# Altium schematic sheet 摄像头直立.SchDoc
size A3
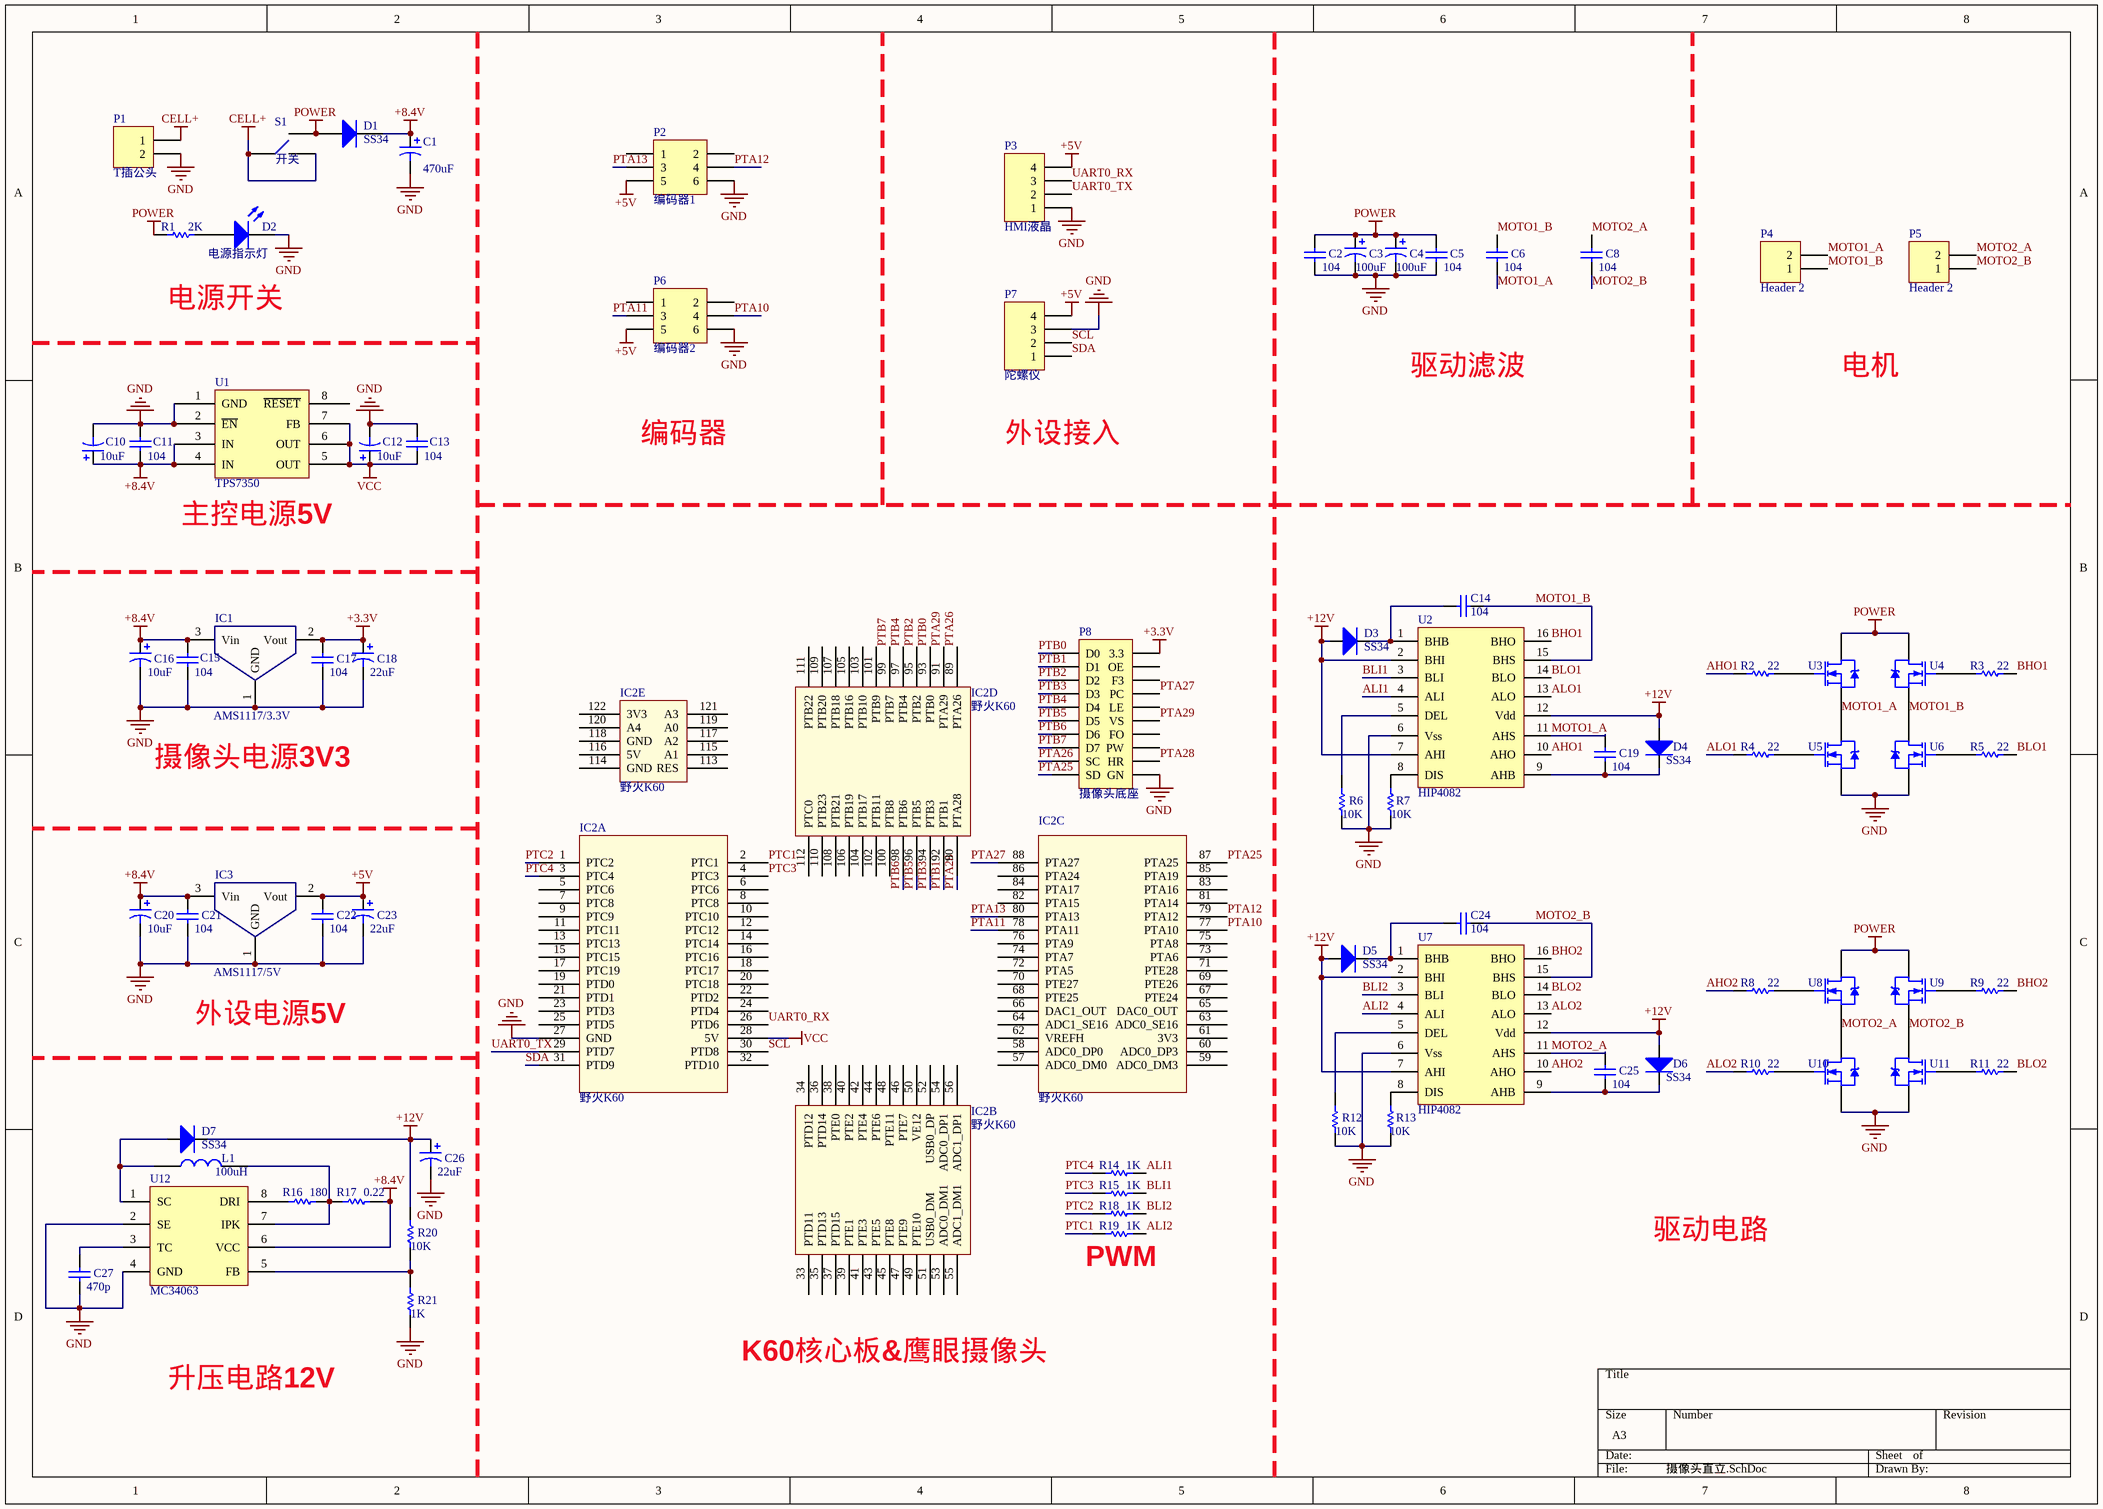
[diagram p0: 摄像头直立.SchDoc]

## Parts
C1  value 470uF  [CAP_ELEC_250P680X1220_FLAT2]  (hidden comment: Cap Pol1)
C2  value 104  [CAP_0805]  (hidden comment: Cap)
C3  value 100uF  [CAP_ELEC_250P680X1220_VERT]
C4  value 100uF  [CAP_ELEC_250P680X1220_VERT]
C5  value 104  [CAP_0805]  (hidden comment: Cap)
C6  value 104  [CAP_0805]  (hidden comment: Cap)
C8  value 104  [CAP_0805]  (hidden comment: Cap)
C10  value 10uF  [CAP_0805]  (hidden comment: Cap)
C11  value 104  [CAP_0805]  (hidden comment: Cap)
C12  value 10uF  [CAP_0805]  (hidden comment: Cap)
C13  value 104  [CAP_0805]  (hidden comment: Cap)
C14  value 104  [CAP_0805]  (hidden comment: Cap)
C15  value 104  [CAP_0805]  (hidden comment: Cap)
C16  value 10uF  [CAP_0805]  (hidden comment: Cap Pol1)
C17  value 104  [CAP_0805]  (hidden comment: Cap)
C18  value 22uF  [CAP_0805]  (hidden comment: Cap Pol1)
C19  value 104  [CAP_0805]
C20  value 10uF  [CAP_0805]  (hidden comment: Cap Pol1)
C21  value 104  [CAP_0805]  (hidden comment: Cap)
C22  value 104  [CAP_0805]  (hidden comment: Cap)
C23  value 22uF  [CAP_0805]  (hidden comment: Cap Pol1)
C24  value 104  [CAP_0805]  (hidden comment: Cap)
C25  value 104  [CAP_0805]
C26  value 22uF  [CAP_0805]  (hidden comment: Cap Pol1)
C27  value 470p  [CAP_0805]  (hidden comment: Cap)
D1  SS34  [SMA]
D2  电源指示灯  [DIO_0805]
D3  SS34  [SMA]
D4  SS34  [SMA]
D5  SS34  [SMA]
D6  SS34  [SMA]
D7  SS34  [SMA]
IC1  AMS1117/3.3V  [SOT_223]
IC2  野火K60  [fireK60]  (parts A,B,C,D,E of 5)
IC3  AMS1117/5V  [SOT_223]
L1  value 100uH  [L-5X4mm-S]  (hidden comment: inductor)
P1  T插公头  [T(G)]
P2  编码器1  [201R2X3]
P3  HMI液晶  [HDR1*4]
P4  Header 2  [CON_5.08*2]
P5  Header 2  [CON_5.08*2]
P6  编码器2  [201R2X3]
P7  陀螺仪  [HDR1*4]
P8  摄像头底座  [摄像头]
R1  value 2K  [RES_0805]  (hidden comment: Res1)
R2  value 22  [RES_0805]  (hidden comment: Res1)
R3  value 22  [RES_0805]  (hidden comment: Res1)
R4  value 22  [RES_0805]  (hidden comment: Res1)
R5  value 22  [RES_0805]  (hidden comment: Res1)
R6  value 10K  [RES_0805]  (hidden comment: Res1)
R7  value 10K  [RES_0805]  (hidden comment: Res1)
R8  value 22  [RES_0805]  (hidden comment: Res1)
R9  value 22  [RES_0805]  (hidden comment: Res1)
R10  value 22  [RES_0805]  (hidden comment: Res1)
R11  value 22  [RES_0805]  (hidden comment: Res1)
R12  value 10K  [RES_0805]  (hidden comment: Res1)
R13  value 10K  [RES_0805]  (hidden comment: Res1)
R14  value 1K  [RES_0805]
R15  value 1K  [RES_0805]
R16  value 180  [RES_0805]
R17  value 0.22  [RES_1206]
R18  value 1K  [RES_0805]
R19  value 1K  [RES_0805]
R20  value 10K  [RES_0805]
R21  value 1K  [RES_0805]
S1  开关  [slide_switch]
U1  TPS7350  [SOP_8]
U2  HIP4082  [HIP4082b]
U3  irlr7843  [TO-252AA]  (value not drawn)
U4  irlr7843  [TO-252AA]  (value not drawn)
U5  irlr7843  [TO-252AA]  (value not drawn)
U6  irlr7843  [TO-252AA]  (value not drawn)
U7  HIP4082  [HIP4082b]
U8  irlr7843  [TO-252AA]  (value not drawn)
U9  irlr7843  [TO-252AA]  (value not drawn)
U10  irlr7843  [TO-252AA]  (value not drawn)
U11  irlr7843  [TO-252AA]  (value not drawn)
U12  MC34063  [SOP_8]

## Nets
+3.3V: C17.2 C18.1 IC1.2(Vout) P8.2(3.3)
+5V: C22.2 C23.1 IC3.2(Vout) P2.5 P3.4 P6.5 P7.4
+8.4V: C1.1 C10.1 C11.1 C15.2 C16.1 C20.1 C21.2 D1.2(K) IC1.3(Vin) IC3.3(Vin) R17.1 U1.3(IN) U1.4(IN) U12.6(VCC)
+12V: C26.1 D3.1(A) D4.1(A) D5.1(A) D6.1(A) D7.2(K) R20.2 U2.2(BHI) U2.7(AHI) U2.12(Vdd) U7.2(BHI) U7.7(AHI) U7.12(Vdd)
CELL+: P1.1 S1.1 S1.3
GND: C1.2 C2.2 C3.2 C4.2 C5.2 C10.2 C11.2 C12.2 C13.1 C15.1 C16.2 C17.1 C18.2 C20.2 C21.1 C22.1 C23.2 C26.2 C27.1 D2.2(K) IC1.1(GND) IC2.27(GND) IC3.1(GND) P1.2 P2.6 P3.1 P6.6 P7.3 P8.20(GN) R6.1 R7.1 R12.1 R13.1 R21.1 U1.1(GND) U1.2(~{EN}) U2.6(Vss) U5.S U6.S U7.6(Vss) U10.S U11.S U12.2(SE) U12.4(GND)
POWER: C2.1 C3.1 C4.1 C5.1 D1.1(A) R1.2 S1.2 U3.D U4.D U8.D U9.D
VCC: C12.1 C13.2 IC2.28(5V) U1.5(OUT) U1.6(OUT) U1.7(FB)
AHO1: R2.2 U2.10(AHO)
AHO2: R8.2 U7.10(AHO)
ALI1: R14.1 U2.4(ALI)
ALI2: R19.1 U7.4(ALI)
ALO1: R4.2 U2.13(ALO)
ALO2: R10.2 U7.13(ALO)
BHO1: R3.1 U2.16(BHO)
BHO2: R9.1 U7.16(BHO)
BLI1: R15.1 U2.3(BLI)
BLI2: R18.1 U7.3(BLI)
BLO1: R5.1 U2.14(BLO)
BLO2: R11.1 U7.14(BLO)
MOTO1_A: C6.2 C19.2 P4.2 U2.11(AHS) U3.S U5.D
MOTO1_B: C6.1 C14.1 P4.1 U2.15(BHS) U4.S U6.D
MOTO2_A: C8.1 C25.2 P5.2 U7.11(AHS) U8.S U10.D
MOTO2_B: C8.2 C24.1 P5.1 U7.15(BHS) U9.S U11.D
PTA10: IC2.77(PTA10) P6.4
PTA11: IC2.78(PTA11) P6.3
PTA12: IC2.79(PTA12) P2.4
PTA13: IC2.80(PTA13) P2.3
PTA25: IC2.87(PTA25) P8.19(SD)
PTA26: IC2.89(PTA26) P8.17(SC)
PTA27: IC2.88(PTA27) P8.8(PC)
PTA28: IC2.90(PTA28) P8.18(HR)
PTA29: IC2.91(PTA29) P8.12(VS)
PTB0: IC2.93(PTB0) P8.1(D0)
PTB1: IC2.92(PTB1) P8.3(D1)
PTB2: IC2.95(PTB2) P8.5(D2)
PTB3: IC2.94(PTB3) P8.7(D3)
PTB4: IC2.97(PTB4) P8.9(D4)
PTB5: IC2.96(PTB5) P8.11(D5)
PTB6: IC2.98(PTB6) P8.13(D6)
PTB7: IC2.99(PTB7) P8.15(D7)
PTC1: IC2.2(PTC1) R19.2
PTC2: IC2.1(PTC2) R18.2
PTC3: IC2.4(PTC3) R15.2
PTC4: IC2.3(PTC4) R14.2
SCL: IC2.30(PTD8) P7.2
SDA: IC2.31(PTD9) P7.1
UART0_RX: IC2.26(PTD6) P3.3
UART0_TX: IC2.29(PTD7) P3.2
NetC14_2: C14.2 D3.2(K) U2.1(BHB)
NetC19_1: C19.1 D4.2(K) U2.9(AHB)
NetC24_2: C24.2 D5.2(K) U7.1(BHB)
NetC25_1: C25.1 D6.2(K) U7.9(AHB)
NetC27_2: C27.2 U12.3(TC)
NetD2_1: D2.1(A) R1.1
NetD7_1: D7.1(A) L1.1 U12.1(SC)
NetL1_2: L1.2 R16.1 R17.2 U12.7(IPK)
NetR2_1: R2.1 U3.G
NetR3_2: R3.2 U4.G
NetR4_1: R4.1 U5.G
NetR5_2: R5.2 U6.G
NetR6_2: R6.2 U2.5(DEL)
NetR7_2: R7.2 U2.8(DIS)
NetR8_1: R8.1 U8.G
NetR9_2: R9.2 U9.G
NetR10_1: R10.1 U10.G
NetR11_2: R11.2 U11.G
NetR12_2: R12.2 U7.5(DEL)
NetR13_2: R13.2 U7.8(DIS)
NetR16_2: R16.2 U12.8(DRI)
NetR20_1: R20.1 R21.2 U12.5(FB)

Not connected (* = marked no-connect by the designer): IC2 5(PTC6) 6(PTC6) 7(PTC8) 8(PTC8) 9(PTC9) 10(PTC10) 11(PTC11) 12(PTC12) 13(PTC13) 14(PTC14) 15(PTC15) 16(PTC16) 17(PTC19) 18(PTC17) 19(PTD0) 20(PTC18) 21(PTD1) 22(PTD2) 23(PTD3) 24(PTD4) 25(PTD5) 32(PTD10) 33(PTD11) 34(PTD12) 35(PTD13) 36(PTD14) 37(PTD15) 38(PTE0) 39(PTE1) 40(PTE2) 41(PTE3) 42(PTE4) 43(PTE5) 44(PTE6) 45(PTE8) 46(PTE7) 47(PTE9) 48(PTE11) 49(PTE10) 50(VE12) 51(USB0_DM) 52(USB0_DP) 53(ADC0_DM1) 54(ADC0_DP1) 55(ADC1_DM1) 56(ADC1_DP1) 57(ADC0_DM0) 58(ADC0_DP0) 59(ADC0_DM3) 60(ADC0_DP3) 61(3V3) 62(VREFH) 63(ADC0_SE16) 64(ADC1_SE16) 65(DAC0_OUT) 66(DAC1_OUT) 67(PTE24) 68(PTE25) 69(PTE26) 70(PTE27) 71(PTE28) 72(PTA5) 73(PTA6) 74(PTA7) 75(PTA8) 76(PTA9) 81(PTA14) 82(PTA15) 83(PTA16) 84(PTA17) 85(PTA19) 86(PTA24) 100(PTB8) 101(PTB9) 102(PTB11) 103(PTB10) 104(PTB17) 105(PTB16) 106(PTB19) 107(PTB18) 108(PTB21) 109(PTB20) 110(PTB23) 111(PTB22) 112(PTC0) 113(RES) 114(GND) 115(A1) 116(5V) 117(A2) 118(GND) 119(A0) 120(A4) 121(A3) 122(3V3); P2 1 2; P6 1 2; P8 4(OE) 6(F3) 10(LE) 14(FO) 16(PW); U1 8(~{RESET})

## Notes on the sheet
- 电源开关
- 驱动滤波
- 电机
- 编码器
- 外设接入
- (near U1) 主控电源5V
- 摄像头电源3V3
- 外设电源5V
- 驱动电路
- (near R19) PWM
- 升压电路12V
- K60核心板&鹰眼摄像头

## Library data of the parts
C1 C3 C4 C10 C12 C16 C18 C20 C23 C26 = Cap Pol1: Polarized Capacitor (Radial); Published: 8-Jun-2000; LatestRevisionDate: 17-Jul-2002; LatestRevisionNote: Re-released for DXP Platform.; PackageReference: RB7.6-15; Publisher: Altium Limited; PackageDescription: Polarized Capacitor (Radial); 2 Leads
C2 C5 C6 C8 C11 C13-C15 C17 C19 C21 C22 C24 C25 C27 = Cap: Capacitor; Published: 8-Jun-2000; LatestRevisionDate: 17-Jul-2002; LatestRevisionNote: Re-released for DXP Platform.; PackageReference: RAD-0.3; Publisher: Altium Limited; PackageDescription: Radial Cap, Thru-Hole; 2 Leads; 0.3 in Pin Spacing
D1 = Diode: Default Diode; Published: 8-Jun-2000; LatestRevisionDate: 17-Jul-2002; LatestRevisionNote: Re-released for DXP Platform.; PackageVersion: Sep-1996; PackageReference: SMC; Publisher: Altium Limited; PackageDescription: DO-214-AB/SMC; 2 C-Bend Leads; Body 7.9 x 5.9 mm, inc. leads (LxW); Code_JEDEC: DO-214-AB
D2 = LED0: Typical INFRARED GaAs LED; Published: 8-Jun-2000; LatestRevisionDate: 08-Jul-2005; LatestRevisionNote: Mech Layer 1 removed.; PackageReference: LED-0; Publisher: Altium Limited; PackageDescription: LED; 2 Leads
D3-D7 = 1n4007_2010
IC1 IC3 = AMS1117
L1 = inductor_CD43贴片
P1 P4 P5 = Header 2: Header, 2-Pin; LatestRevisionDate: 17-Jul-2002; LatestRevisionNote: Re-released for DXP Platform.; Publisher: Altium Limited
P2 P6 = Header 3X2: Header, 3-Pin, Dual row; LatestRevisionDate: 17-Jul-2002; LatestRevisionNote: Re-released for DXP Platform.; Publisher: Altium Limited
P3 P7 = Header 4: Header, 4-Pin; LatestRevisionDate: 17-Jul-2002; LatestRevisionNote: Re-released for DXP Platform.; Publisher: Altium Limited
P8 = Header 10X2H: Header, 10-Pin, Dual row, Right Angle; LatestRevisionDate: 17-Jul-2002; LatestRevisionNote: Re-released for DXP Platform.; Publisher: Altium Limited
R1-R21 = Res1: Resistor; Published: 8-Jun-2000; LatestRevisionDate: 17-Jul-2002; LatestRevisionNote: Re-released for DXP Platform.; PackageReference: AXIAL-0.3; Publisher: Altium Limited; PackageDescription: Axial Device, Thru-Hole; 2 Leads; 0.3 in Pin Spacing
S1 = slide_switch
U1 = TPS73XX